# EAGLE design Sensor Decoderv0.5 (EAGLE 8.2.2)
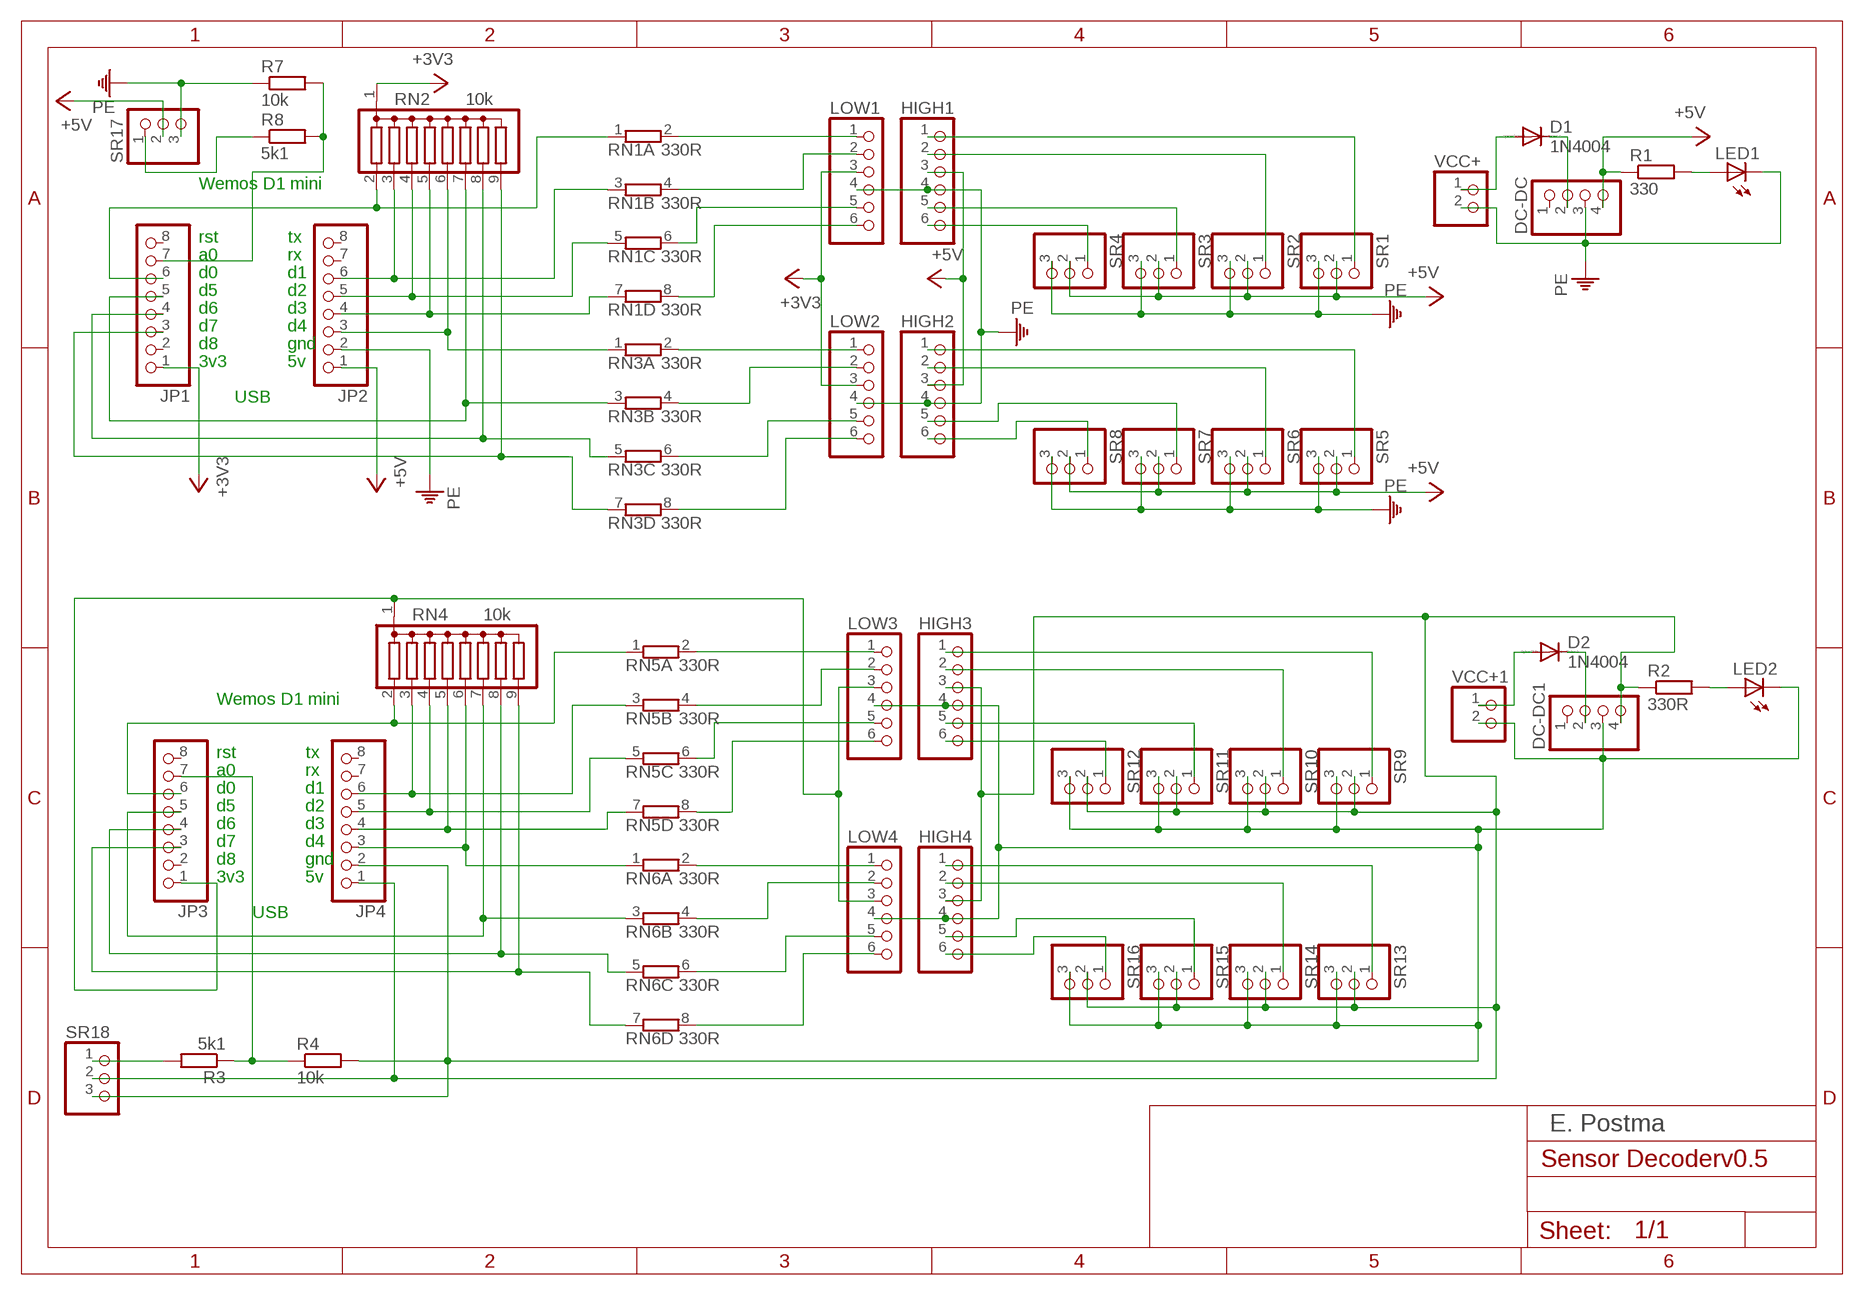
[diagram p0: schematic, sheet 1]

## Parts
D1  1N4004  [DO41-10]
D2  1N4004  [DO41-10]
DC-DC  PINHD-1X4  [1X04]
DC-DC1  PINHD-1X4  [1X04]
HIGH1  PINHD-1X6  [1X06]
HIGH2  PINHD-1X6  [1X06]
HIGH3  PINHD-1X6  [1X06]
HIGH4  PINHD-1X6  [1X06]
JP1  PINHD-1X8  [1X08]
JP2  PINHD-1X8  [1X08]
JP3  PINHD-1X8  [1X08]
JP4  PINHD-1X8  [1X08]
LED1  LED3MM  [LED3MM]
LED2  LED3MM  [LED3MM]
LOW1  PINHD-1X6  [1X06]
LOW2  PINHD-1X6  [1X06]
LOW3  PINHD-1X6  [1X06]
LOW4  PINHD-1X6  [1X06]
R1  330  R-EU_0207/7  [0207/7]
R2  330R  R-EU_0207/7  [0207/7]
R3  5k1  R-EU_0207/7  [0207/7]
R4  10k  R-EU_0207/7  [0207/7]
R7  10k  R-EU_0207/7  [0207/7]
R8  5k1  R-EU_0207/7  [0207/7]
RN1  330R  E4R  [SIL8]
RN2  10k  G08R  [SIL9]
RN3  330R  E4R  [SIL8]
RN4  10k  G08R  [SIL9]
RN5  330R  E4R  [SIL8]
RN6  330R  E4R  [SIL8]
SR1  PINHD-1X3  [1X03]
SR2  PINHD-1X3  [1X03]
SR3  PINHD-1X3  [1X03]
SR4  PINHD-1X3  [1X03]
SR5  PINHD-1X3  [1X03]
SR6  PINHD-1X3  [1X03]
SR7  PINHD-1X3  [1X03]
SR8  PINHD-1X3  [1X03]
SR9  PINHD-1X3  [1X03]
SR10  PINHD-1X3  [1X03]
SR11  PINHD-1X3  [1X03]
SR12  PINHD-1X3  [1X03]
SR13  PINHD-1X3  [1X03]
SR14  PINHD-1X3  [1X03]
SR15  PINHD-1X3  [1X03]
SR16  PINHD-1X3  [1X03]
SR17  PINHD-1X3  [1X03]
SR18  PINHD-1X3  [1X03]
VCC+  PINHD-1X2  [1X02]
VCC+1  PINHD-1X2  [1X02]

## Nets
+3V3 [3.3V]: JP1.1 LOW1.3 LOW2.3 RN2.1
+5V [5V]: DC-DC.4 HIGH1.3 HIGH2.3 JP2.1 R1.1 SR1.2 SR2.2 SR3.2 SR4.2 SR5.2 SR6.2 SR7.2 SR8.2 SR17.2
N$1: HIGH2.6 SR8.1
N$2: JP1.6 RN1.1 RN2.2
N$3: JP1.4 RN2.8 RN3.5
N$4 [5V]: D1.C DC-DC.2
N$5: JP1.5 RN2.7 RN3.3
N$6: LED1.A R1.2
N$7: JP2.5 RN1.5 RN2.4
N$8: HIGH2.5 SR7.1
N$9: JP2.3 RN2.6 RN3.1
N$10: JP2.6 RN1.3 RN2.3
N$11: JP1.3 RN2.9 RN3.7
N$12: LOW1.1 RN1.2
N$13: JP2.4 RN1.7 RN2.5
N$14: HIGH1.6 SR4.1
N$15: HIGH1.5 SR3.1
N$16: HIGH1.2 SR2.1
N$17: HIGH1.1 SR1.1
N$18: HIGH2.2 SR6.1
N$19: HIGH2.1 SR5.1
N$20: JP3.6 RN4.2 RN5.1
N$21: LED2.A R2.2
N$22: JP4.6 RN4.3 RN5.3
N$23: JP4.5 RN4.4 RN5.5
N$24: JP4.4 RN4.5 RN5.7
N$25 [5V]: D2.A VCC+1.1
N$26 [5V]: D2.C DC-DC1.2
N$27: JP4.3 RN4.6 RN6.1
N$28: JP3.5 RN4.7 RN6.3
N$29: JP3.4 RN4.8 RN6.5
N$30: JP3.3 RN4.9 RN6.7
N$31: LOW3.1 RN5.2
N$32: LOW3.2 RN5.4
N$33: LOW3.5 RN5.6
N$34: LOW3.6 RN5.8
N$35: LOW4.1 RN6.2
N$36: LOW4.2 RN6.4
N$37: LOW4.5 RN6.6
N$38: LOW4.6 RN6.8
N$39: HIGH4.6 SR16.1
N$40: HIGH4.5 SR15.1
N$41: HIGH4.2 SR14.1
N$42: HIGH4.1 SR13.1
N$43: HIGH3.6 SR12.1
N$44: LOW1.2 RN1.4
N$45: LOW1.5 RN1.6
N$46: LOW1.6 RN1.8
N$47 [5V]: D1.A VCC+.1
N$48: LOW2.1 RN3.2
N$49: LOW2.2 RN3.4
N$50: LOW2.5 RN3.6
N$51: LOW2.6 RN3.8
N$52: HIGH3.5 SR11.1
N$53: HIGH3.2 SR10.1
N$54: HIGH3.1 SR9.1
N$55 [5V]: DC-DC1.4 HIGH3.3 HIGH4.3 JP4.1 R2.1 SR9.2 SR10.2 SR11.2 SR12.2 SR13.2 SR14.2 SR15.2 SR16.2 SR18.2
N$56 [3.3V]: JP3.1 LOW3.3 LOW4.3 RN4.1
N$57 [Gnd]: DC-DC1.3 HIGH3.4 HIGH4.4 JP4.2 LED2.K(C) LOW3.4 LOW4.4 R4.2 SR9.3 SR10.3 SR11.3 SR12.3 SR13.3 SR14.3 SR15.3 SR16.3 SR18.3 VCC+1.2
N$58: JP1.7 R7.2 R8.2
N$59: JP3.7 R3.1 R4.1
N$60: R3.2 SR18.1
N$62: R8.1 SR17.1
PE [Gnd]: DC-DC.3 HIGH1.4 HIGH2.4 JP2.2 LED1.K(C) LOW1.4 LOW2.4 R7.1 SR1.3 SR2.3 SR3.3 SR4.3 SR5.3 SR6.3 SR7.3 SR8.3 SR17.3 VCC+.2
Unconnected: DC-DC1.1 DC-DC.1 JP1.2 JP1.8 JP2.7 JP2.8 JP3.2 JP3.8 JP4.7 JP4.8

## Notes on the sheet
- Wemos D1 mini
- rst | tx
- a0 | rx
- d0 | d1
- d5 | d2
- d6 | d3
- d7 | d4
- d8 | gnd
- 3v3 | 5v
- USB
- Wemos D1 mini
- rst | tx
- a0 | rx
- d0 | d1
- d5 | d2
- d6 | d3
- d7 | d4
- d8 | gnd
- 3v3 | 5v
- USB
- E. Postma

## Library data of the parts
D1 D2 = diode:1N4004: DIODE general purpose rectifier, 1 A
DC-DC DC-DC1 = pinhead:PINHD-1X4: PIN HEADER
HIGH1-HIGH4 LOW1-LOW4 = pinhead:PINHD-1X6: PIN HEADER
JP1-JP4 = pinhead:PINHD-1X8: PIN HEADER
LED1 LED2 = led:LED: LED OSRAM: - CHIPLED LG R971, LG N971, LY N971, LG Q971, LY Q971, LO R971, LY R971 LH N974, LH R974 LS Q976, LO Q976, LY Q976 LO Q996 - Hyper CHIPLED LW Q18S LB Q993, LB Q99A, LB R99A - SideLED LS A670, LO A670, LY A670, LG A670, LP A670 LB A673, LV A673, LT A673, LW A673 LH A674 LY A675 LS A676, LA A676, LO A676, LY A676, LW A676 LS A679, LY A679, LG A679 - Hyper Micro SIDELED® LS Y876, LA Y876, LO Y876, LY Y876 LT Y87S - SmartLED LW L88C, LW L88S LB L89C, LB L89S, LG L890 LS L89K, LO L89K, LY L89K LS L896, LA L896, LO L896, LY L896 - TOPLED LS T670, LO T670, LY T670, LG T670, LP T670 LSG T670, LSP T670, LSY T670, LOP T670, LYG T670 LG T671, LOG T671, LSG T671 LB T673, LV T673, LT T673, LW T673 LH T674 LS T676, LA T676, LO T676, LY T676, LB T676, LH T676, LSB T676, LW T676 LB T67C, LV T67C, LT T67C, LS T67K, LO T67K, LY T67K, LW E67C LS E67B, LA E67B, LO E67B, LY E67B, LB E67C, LV E67C, LT E67C LW T67C LS T679, LY T679, LG T679 LS T770, LO T770, LY T770, LG T770, LP T770 LB T773, LV T773, LT T773, LW T773 LH T774 LS E675, LA E675, LY E675, LS T675 LS T776, LA T776, LO T776, LY T776, LB T776 LHGB T686 LT T68C, LB T68C - Hyper Mini TOPLED® LB M676 - Mini TOPLED Santana® LG M470 LS M47K, LO M47K, LY M47K Source: http://www.osram.convergy.de LUXEON: - LUMILED® LXK2-PW12-R00, LXK2-PW12-S00, LXK2-PW14-U00, LXK2-PW14-V00 LXK2-PM12-R00, LXK2-PM12-S00, LXK2-PM14-U00 LXK2-PE12-Q00, LXK2-PE12-R00, LXK2-PE12-S00, LXK2-PE14-T00, LXK2-PE14-U00 LXK2-PB12-K00, LXK2-PB12-L00, LXK2-PB12-M00, LXK2-PB14-N00, LXK2-PB14-P00, LXK2-PB14-Q00 LXK2-PR12-L00, LXK2-PR12-M00, LXK2-PR14-Q00, LXK2-PR14-R00 LXK2-PD12-Q00, LXK2-PD12-R00, LXK2-PD12-S00 LXK2-PH12-R00, LXK2-PH12-S00 LXK2-PL12-P00, LXK2-PL12-Q00, LXK2-PL12-R00 Source: www.luxeon.com KINGBRIGHT: KA-3528ASYC Source: www.kingbright.com
R1-R4 R7 R8 = resistor:R-EU_: RESISTOR, European symbol
RN1 RN3 RN5 RN6 = resistor-sil:E4R: SIL RESISTOR; OC_FARNELL: unknown; OC_NEWARK: unknown
RN2 RN4 = resistor-sil:G08R: SIL RESISTOR; OC_FARNELL: unknown; OC_NEWARK: unknown
SR1-SR18 = pinhead:PINHD-1X3: PIN HEADER
VCC+ VCC+1 = pinhead:PINHD-1X2: PIN HEADER

## Net classes
0 default: width 0.508 mm, clearance 0.254 mm
1 5V: width 0.762 mm, clearance 0.254 mm
2 Gnd: width 0.762 mm, clearance 0.254 mm
3 extra: width 0.762 mm, clearance 0.254 mm
4 3.3V: width 0.508 mm, clearance 0.254 mm

## Board
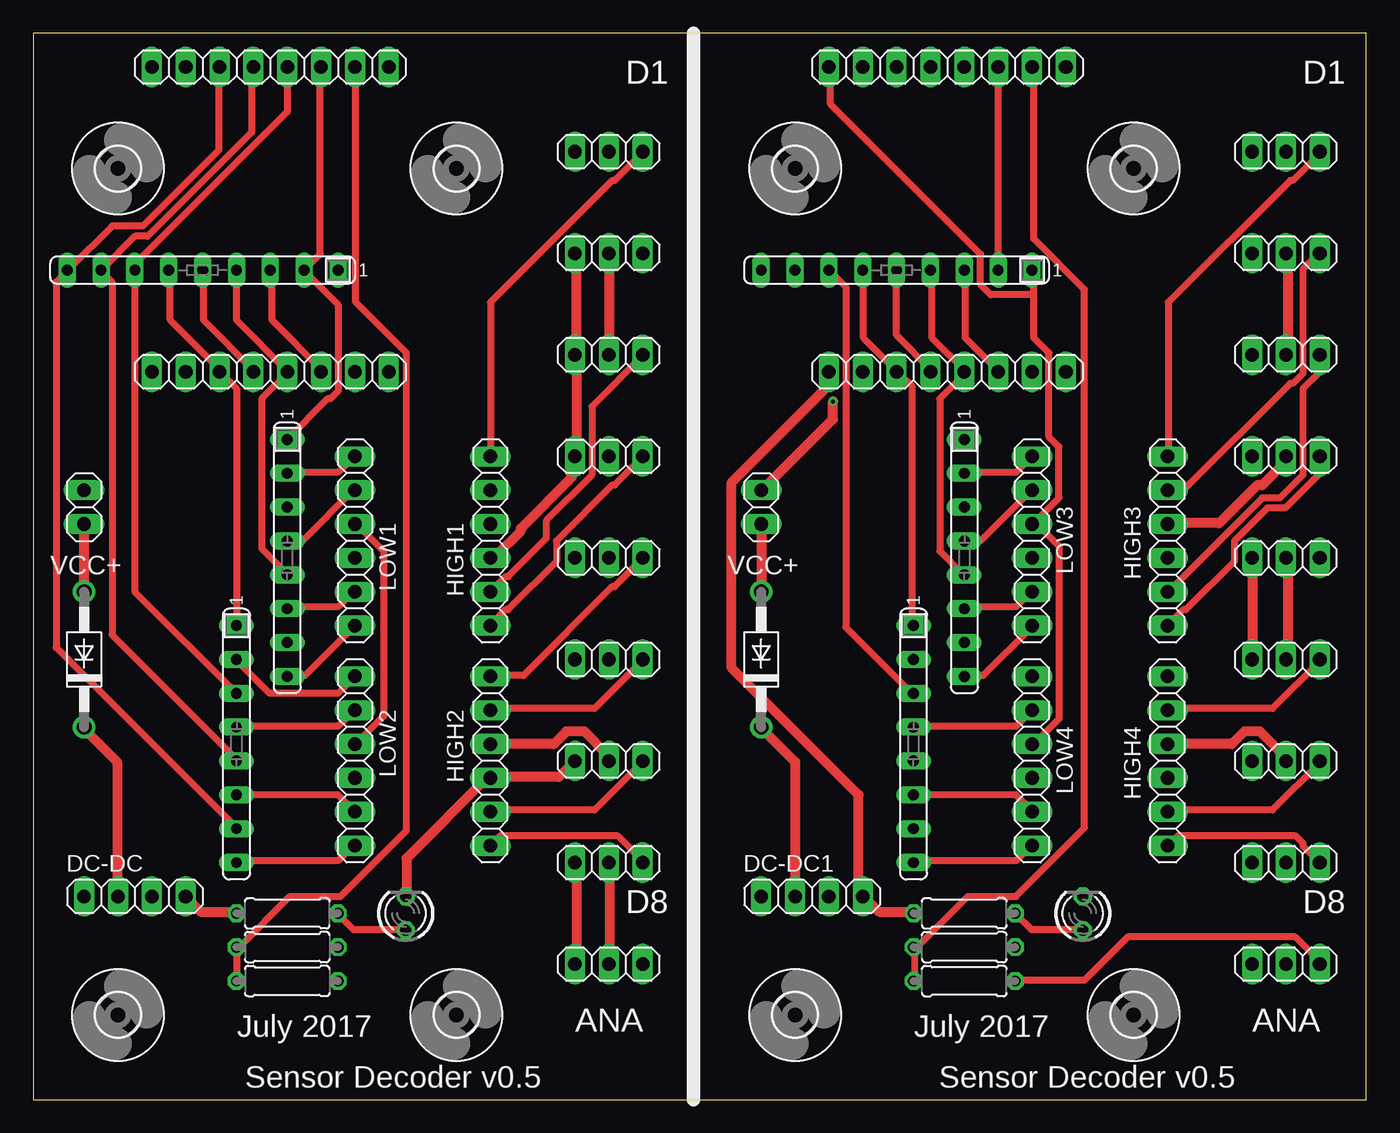
[diagram p1: board, top side]
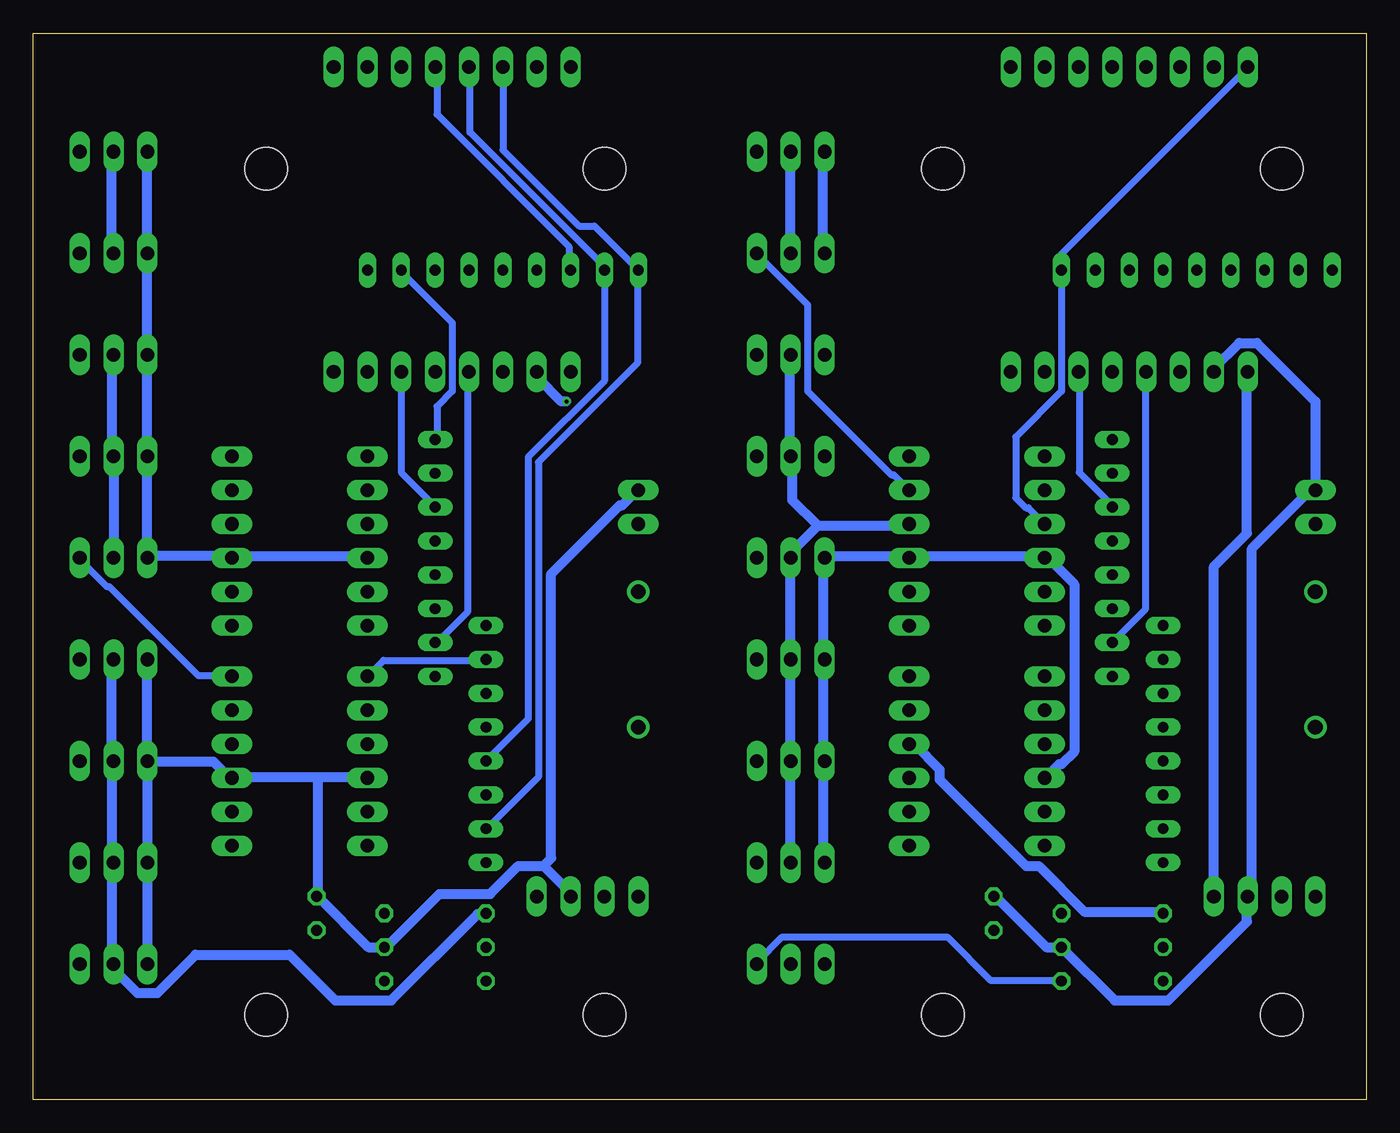
[diagram p2: board, bottom side, seen from below]

Size 100 x 80 mm. Coordinates in mm from the lower left corner, seen from the top.
Outline: 0,0 100,0 100,80 0,80 0,0
Copper layers (1*16): Top 0.035mm / dielectric 1.5mm / Bottom 0.035mm
Design rules "NOA Eagle Rule 2016-06-12": minimum track width 6mil, minimum drill 0.3mm, track to track 6mil, track to pad 6mil, pad to pad 6mil, via to via 6mil, smd to smd 0mil, copper to edge 0.4mm, drill to drill 10mil, minimum pad ring 10mil, minimum via ring 6mil, stop-mask expansion 2mil, vias tented up to drill 25mil, thermal gap 10mil
tKeepout: 1 lines
tRestrict: 1 lines
bRestrict: 1 lines

### Footprints (pad centres in the part's own frame; a part is rotated, then mirrored left to right if it is on the bottom)
DO41-10 = drill 1.118: A 5.08,0; C -5.08,0
1X04 = drill 1.016 long: 1 -3.81,0; 2 -1.27,0; 3 1.27,0; 4 3.81,0
1X06 = drill 1.016 long: 1 -6.35,0; 2 -3.81,0; 3 -1.27,0; 4 1.27,0; 5 3.81,0; 6 6.35,0
1X08 = drill 1.016 long: 1 -8.89,0; 2 -6.35,0; 3 -3.81,0; 4 -1.27,0; 5 1.27,0; 6 3.81,0; 7 6.35,0; 8 8.89,0
LED3MM = drill 0.813 octagon: A -1.27,0; K 1.27,0
0207/7 = drill 0.813 octagon: 1 -3.81,0; 2 3.81,0
SIL8 = drill 0.813 long: 1 -8.89,0; 2 -6.35,0; 3 -3.81,0; 4 -1.27,0; 5 1.27,0; 6 3.81,0; 7 6.35,0; 8 8.89,0
SIL9 = drill 0.813 long: 1 -10.16,0; 2 -7.62,0; 3 -5.08,0; 4 -2.54,0; 5 0,0; 6 2.54,0; 7 5.08,0; 8 7.62,0; 9 10.16,0
1X03 = drill 1.016 long: 1 -2.54,0; 2 0,0; 3 2.54,0
3,2 = hole 3.2: 0,0
1X02 = drill 1.016 long: 1 -1.27,0; 2 1.27,0

### Placement (x,y rotation side)
D1  3.81,33.02 90 top
D2  54.61,33.02 90 top
DC-DC  7.62,15.24 0 top
DC-DC1  58.42,15.24 0 top
HIGH1  34.29,41.91 270 top
HIGH2  34.29,25.4 270 top
HIGH3  85.09,41.91 270 top
HIGH4  85.09,25.4 270 top
JP1  17.78,77.47 0 top
JP2  17.78,54.61 0 top
JP3  68.58,77.47 0 top
JP4  68.58,54.61 0 top
LED1  27.94,13.97 90 top
LED2  78.74,13.97 90 top
LOW1  24.13,41.91 270 top
LOW2  24.13,25.4 270 top
LOW3  74.93,41.91 270 top
LOW4  74.93,25.4 270 top
R1  19.05,13.97 0 top
R2  69.85,13.97 0 top
R3  69.85,8.89 0 top
R4  69.85,11.43 0 top
R7  19.05,11.43 180 top
R8  19.05,8.89 180 top
RN1  19.05,40.64 270 top
RN2  12.7,62.23 180 top
RN3  15.24,26.67 270 top
RN4  64.77,62.23 180 top
RN5  69.85,40.64 270 top
RN6  66.04,26.67 270 top
SR1  43.18,71.12 180 top
SR2  43.18,63.5 180 top
SR3  43.18,55.88 180 top
SR4  43.18,48.26 180 top
SR5  43.18,40.64 180 top
SR6  43.18,33.02 180 top
SR7  43.18,25.4 180 top
SR8  43.18,17.78 180 top
SR9  93.98,71.12 180 top
SR10  93.98,63.5 180 top
SR11  93.98,55.88 180 top
SR12  93.98,48.26 180 top
SR13  93.98,40.64 180 top
SR14  93.98,33.02 180 top
SR15  93.98,25.4 180 top
SR16  93.98,17.78 180 top
SR17  43.18,10.16 180 top
SR18  93.98,10.16 180 top
U$1  [3,2]  6.35,69.85 0 top
U$2  [3,2]  31.75,69.85 0 top
U$3  [3,2]  6.35,6.35 0 top
U$4  [3,2]  31.75,6.35 0 top
U$5  [3,2]  57.15,6.35 0 top
U$6  [3,2]  82.55,6.35 0 top
U$7  [3,2]  57.15,69.85 0 top
U$8  [3,2]  82.55,69.85 0 top
VCC+  3.81,44.45 90 top
VCC+1  54.61,44.45 90 top

### Tracks (layer width: path | path; a pad name or v marks a point on that pad's centre or on a via)
+3V3
  Top 0.508: LOW2.3 24.19,26.67 26.29,28.77 26.29,41.15 24.19,43.24 LOW1.3
  Bottom 0.508: JP1.1 8.95,77.34 22.86,63.44 RN2.1 22.86,53.15 26.29,49.72 26.29,45.15 25.53,44.39 25.34,44.39 LOW1.3
+5V
  Top 0.762: DC-DC.4 12.57,14.1 15.24,14.1 R1.1 | SR17.2 43.24,10.29 43.24,17.72 SR8.2 | HIGH2.3 39.05,26.67 40.01,27.62 41.34,27.62 43.05,25.91 43.05,25.53 SR7.2 | SR2.2 43.24,63.44 43.24,56.01 SR3.2
  Bottom 0.762: DC-DC.4 11.43,40.01 8.95,42.48 8.95,54.48 JP2.1 | SR8.2 43.24,17.91 43.24,25.34 SR7.2 43.24,25.72 43.24,32.77 SR6.2 43.24,33.15 43.24,40.39 SR5.2 43.05,40.77 43.05,41.15 41.15,43.05 | SR2.2 43.24,63.63 43.24,71.06 SR1.2 | 41.15,43.05 34.29,43.05 HIGH1.3 | 41.15,43.05 43.05,44.96 43.05,48.2 SR4.2 43.24,48.58 43.24,55.82 SR3.2 | HIGH2.3 33.91,26.67 32,24.77 32,24 25.53,17.53 24.57,17.53 21.14,14.1 15.24,14.1 R1.1
N$1
  Top 0.508: HIGH2.6 35.05,19.81 43.81,19.81 45.72,17.91 SR8.1
N$2
  Top 0.508: RN1.1 22.1,52.58 22.29,52.58 22.86,53.15 22.86,59.63 20.38,62.1 RN2.2 21.53,63.44 21.53,77.34 JP1.6
N$3
  Top 0.508: JP1.4 16.38,77.34 16.38,72.58 8.57,64.77 7.62,64.77 RN2.8 5.14,62.1 5.91,61.34 5.91,34.86 15.24,25.53 RN3.5
N$4
  Top 0.762: DC-DC.2 6.29,15.24 6.29,25.34 3.81,27.81 D1.C
N$5
  Top 0.508: JP1.5 19.05,74.11 7.62,62.67 RN2.7 7.62,38.1 RN3.3
N$6
  Top 0.508: LED1.A 27.81,12.76 24,12.76 22.86,13.91 R1.2
N$7
  Top 0.508: RN2.4 15.24,58.48 19.05,54.67 JP2.5 19.05,54.48 17.14,52.58 17.14,41.34 19.05,39.43 RN1.5
N$8
  Top 0.508: HIGH2.5 34.29,21.72 42.1,21.72 45.72,25.34 SR7.1
N$9
  Top 0.508: RN2.6 10.29,62.1 10.29,58.48 14.1,54.67 JP2.3 15.24,53.34 RN3.1
N$10
  Top 0.508: RN2.3 17.91,62.1 17.91,58.48 21.72,54.67 JP2.6
  Bottom 0.508: RN1.3 19.05,44.58 21.53,47.05 21.53,54.48 JP2.6
N$11
  Top 0.508: JP1.3 13.91,77.34 13.91,71.25 8.19,65.53 5.91,65.53 2.67,62.29 RN2.9 2.48,62.1 1.71,61.34 1.71,33.91 15.24,20.38 RN3.7
N$12
  Top 0.508: RN1.2 19.05,47.05 22.86,47.05 24,48.2 LOW1.1
N$13
  Top 0.508: RN2.5 12.76,62.1 12.76,58.48 16.57,54.67 JP2.4
  Bottom 0.508: RN1.7 16.57,36.77 16.57,54.48 JP2.4
N$14
  Top 0.508: HIGH1.6 34.29,35.62 35.43,36.77 35.62,36.77 39.24,40.39 39.24,41.91 43.43,46.1 43.62,46.1 45.72,48.2 SR4.1
N$15
  Top 0.508: HIGH1.5 35.43,39.24 35.62,39.24 38.48,42.1 38.48,43.43 41.91,46.86 41.91,52.01 45.72,55.82 SR3.1
N$16
  Bottom 0.508: HIGH1.2 35.43,46.86 35.62,46.86 41.91,53.15 41.91,59.63 45.72,63.44 SR2.1
N$17
  Top 0.508: HIGH1.1 34.29,59.82 43.43,68.96 43.62,68.96 45.72,71.06 SR1.1
N$18
  Top 0.508: HIGH2.2 34.29,29.34 42.1,29.34 45.72,32.96 SR6.1
N$19
  Top 0.508: HIGH2.1 34.29,31.81 36.77,31.81 43.43,38.48 43.62,38.48 45.72,40.58 SR5.1
N$20
  Top 0.508: RN4.2 JP3.6
  Bottom 0.508: RN5.1 69.72,49.53 69.72,52.01 68.58,53.15 68.58,58.29 72.39,62.1 RN4.2
N$21
  Top 0.508: R2.2 74.87,12.76 78.68,12.76 LED2.A
N$22
  Top 0.508: RN4.3 69.91,62.1 69.91,57.15 72.39,54.67 JP4.6
  Bottom 0.508: JP4.6 72.39,47.05 69.91,44.58 RN5.3
N$23
  Top 0.508: RN4.4 67.44,62.1 67.44,57.15 69.91,54.67 JP4.5 69.91,54.48 68.01,52.58 68.01,41.15 69.72,39.43 RN5.5
N$24
  Top 0.508: RN4.5 64.77,57.34 67.44,54.67 JP4.4
  Bottom 0.508: RN5.7 69.72,34.29 67.44,36.58 67.44,54.48 JP4.4
N$25
  Top 0.762: VCC+1.1 54.67,43.05 54.67,38.1 D2.A
N$26
  Top 0.762: DC-DC1.2 57.15,25.34 54.67,27.81 D2.C
N$27
  Top 0.508: RN4.6 62.29,62.1 62.29,57.15 64.77,54.67 JP4.3 64.96,54.48 65.91,53.53 65.91,35.62 RN6.1
N$28
  Top 0.508: RN4.7 60.96,60.96 60.96,35.43 65.91,30.48 RN6.3
  Bottom 0.508: RN4.7 59.82,62.29 59.82,64.01 69.72,73.91 69.72,77.34 JP3.5
N$29
  Bottom 0.508: RN6.5 62.87,28.57 62.87,48.2 57.15,53.91 RN4.8 56.96,62.29 67.25,72.58 67.25,77.34 JP3.4
N$30
  Bottom 0.508: JP3.3 64.77,71.25 59.05,65.53 57.91,65.53 RN4.9 54.67,62.1 54.67,55.24 62.1,47.82 62.1,24.19 65.91,20.38 RN6.7
N$31
  Top 0.508: LOW3.1 73.72,47.05 69.91,47.05 RN5.2
N$32
  Top 0.508: RN5.4 71.06,41.91 74.87,45.72 LOW3.2
N$33
  Top 0.508: RN5.6 69.91,36.96 73.72,36.96 74.87,38.1 LOW3.5
N$34
  Top 0.508: RN5.8 69.91,31.81 71.25,31.81 74.87,35.43 LOW3.6
N$35
  Bottom 0.508: LOW4.1 73.72,32.96 66.1,32.96 RN6.2
N$36
  Top 0.508: LOW4.2 73.72,28 66.1,28 RN6.4
N$37
  Top 0.508: RN6.6 73.72,22.86 74.87,21.72 LOW4.5
N$38
  Top 0.508: RN6.8 66.1,17.91 73.72,17.91 74.87,19.05 LOW4.6
N$39
  Top 0.508: SR16.1 95.25,19.05 95.25,19.24 94.68,19.81 85.92,19.81 85.15,19.05 HIGH4.6
N$40
  Top 0.508: HIGH4.5 85.15,21.72 92.96,21.72 96.58,25.34 SR15.1
N$41
  Top 0.508: HIGH4.2 85.15,29.34 92.96,29.34 96.58,32.96 SR14.1
N$42
  Bottom 0.508: HIGH4.1 85.15,31.81 87.63,31.81 94.3,38.48 94.49,38.48 96.58,40.58 SR13.1
N$43
  Top 0.508: HIGH3.6 86.3,36.77 86.49,36.77 90.11,40.39 90.11,41.91 92.58,44.39 93.92,44.39 96.39,46.86 96.39,48.2 SR12.1
N$44
  Top 0.508: RN1.4 20.19,41.91 24,45.72 LOW1.2
N$45
  Top 0.508: RN1.6 19.05,36.96 22.86,36.96 24,38.1 LOW1.5
N$46
  Top 0.508: LOW1.6 20.38,31.81 19.05,31.81 RN1.8
N$47
  Top 0.762: D1.A VCC+.1
N$48
  Top 0.508: LOW2.1 22.86,30.48 17.72,30.48 15.24,32.96 RN3.2
N$49
  Top 0.508: RN3.4 15.24,28 22.86,28 24,29.15 LOW2.2
N$50
  Top 0.508: RN3.6 22.86,22.86 LOW2.5
N$51
  Top 0.508: RN3.8 15.24,17.91 22.86,17.91 24,19.05 LOW2.6
N$52
  Top 0.508: HIGH3.5 85.15,38.1 92.2,45.15 93.53,45.15 95.25,46.86 95.25,53.34 96.39,54.48 96.39,55.82 SR11.1
N$53
  Top 0.508: HIGH3.2 86.3,45.72 94.3,53.72 94.49,53.72 95.25,54.48 95.25,62.29 96.39,63.44 SR10.1
N$54
  Top 0.508: HIGH3.1 85.15,48.39 85.15,59.82 94.3,68.96 94.49,68.96 96.58,71.06 SR9.1
N$55
  Top 0.762: R2.1 65.91,14.1 63.44,14.1 62.29,15.24 DC-DC1.4 61.91,15.43 61.91,22.86 52.39,32.38 52.39,46.29 59.63,53.53 59.63,54.48 JP4.1 | HIGH3.3 85.15,43.24 88.96,43.24 91.82,46.1 92.2,46.1 93.92,47.82 93.92,48.2 SR12.2 | SR11.2 94.11,56.01 94.11,63.44 SR10.2 | SR14.2 94.11,33.15 94.11,40.58 SR13.2 | HIGH4.3 89.92,26.67 90.87,27.62 92.01,27.62 94.11,25.53 SR15.2
  Bottom 0.762: SR9.2 94.11,71.06 94.11,63.63 SR10.2 | SR11.2 94.11,55.82 94.11,48.39 SR12.2 93.92,48.01 93.92,40.77 SR13.2 | SR14.2 94.11,32.96 94.11,25.72 SR15.2 94.11,25.34 94.11,18.1 SR16.2 94.11,17.72 94.11,10.29 SR18.2 94.11,9.91 92.2,8 90.68,8 87.82,10.86 80.77,10.86 77.34,7.43 73.15,7.43 66.67,13.91 66.1,13.91 R2.1
N$56
  Top 0.508: 75.06,60.39 75.06,57.15 76.2,56.01 76.2,49.72 76.96,48.96 76.96,45.15 75.06,43.24 LOW3.3 75.25,43.24 76.96,41.53 76.96,28.57 75.06,26.67 LOW4.3 | 75.06,60.39 75.06,62.1 RN4.1 | 75.06,60.39 71.82,60.39 71.06,61.15 71.06,63.44 59.82,74.68 59.82,77.34 JP3.1
N$57  (via drill 0.3)
  Top 0.762: v60.01,52.39 60.01,51.05 54.67,45.72 VCC+1.2 | SR13.3 SR14.3
  Bottom 0.762: 61.72,17.53 59.82,15.62 59.82,15.24 DC-DC1.3 | 61.72,17.53 63.63,17.53 65.72,15.43 69.53,15.43 73.34,11.62 R4.2 74.87,11.43 78.68,15.24 LED2.K 78.68,15.43 78.68,24.19 | 61.72,17.53 61.15,18.1 61.15,39.43 56.01,44.58 55.82,44.58 54.67,45.72 VCC+1.2 | v60.01,52.39 60.39,52.39 62.1,54.1 62.1,54.48 JP4.2 | SR18.3 SR16.3 SR15.3 | 78.68,24.19 84.96,24.19 HIGH4.4 85.34,24.19 86.49,25.34 91.44,25.34 SR15.3 | 78.68,24.19 75.06,24.19 LOW4.4 | SR15.3 SR14.3 | LOW3.4 75.06,40.77 84.96,40.77 HIGH3.4 85.34,40.77 91.44,40.77 SR13.3 SR12.3 SR11.3 SR10.3 SR9.3
N$58
  Top 0.508: R8.2 R7.2 15.43,11.43 19.24,15.24 23.05,15.24 28,20.19 28,56.01 24.19,59.82 24.19,77.34 JP1.7
N$59
  Top 0.508: R3.1 66.1,8.95 66.1,11.43 R4.1 66.29,11.43 70.1,15.24 73.72,15.24 78.87,20.38 78.87,60.77 75.06,64.58 75.06,77.34 JP3.7
N$60
  Top 0.508: R3.2 73.72,8.95 78.87,8.95 82.11,12.19 94.68,12.19 96.58,10.29 SR18.1
N$62
  Bottom 0.508: R8.1 22.86,8.95 28.19,8.95 31.43,12.19 43.81,12.19 45.72,10.29 SR17.1
PE
  Top 0.762: SR2.3 40.77,63.44 40.77,56.2 SR3.3 40.77,55.82 40.77,48.39 SR4.3 40.39,48.01 40.39,46.67 36.58,42.86 36.58,42.67 34.67,40.77 34.29,40.77 HIGH1.4 | SR17.3 40.77,10.29 40.77,17.72 SR8.3 | SR7.3 39.43,24.19 34.29,24.19 HIGH2.4 34.1,24.19 28,18.1 28,15.24 LED1.K
  Bottom 0.762: JP2.2 11.43,54.86 9.53,56.77 8.19,56.77 3.81,52.39 VCC+.2 4,45.53 4.38,45.53 8.57,41.34 8.57,15.43 DC-DC.3 8.95,15.24 8.95,13.34 14.86,7.43 18.86,7.43 R7.1 24,11.43 27.81,15.24 LED1.K | SR1.3 40.77,71.06 40.77,63.63 SR2.3 | LOW2.4 24,24.19 23.05,25.15 22.86,25.15 21.91,26.1 21.91,38.67 24,40.77 LOW1.4 24.38,40.77 34.1,40.77 HIGH1.4 34.29,40.77 40.39,40.77 SR5.3 40.77,40.58 40.77,33.15 SR6.3 40.77,32.77 40.77,25.53 SR7.3 40.77,25.15 40.77,17.91 SR8.3

### Text on the board
tNames: D1 | D1 | VCC+ | VCC+ | D8 | D8 | July 2017 | July 2017 | ANA | ANA | Sensor Decoder v0.5 | Sensor Decoder v0.5